# EAGLE design cj732 (EAGLE 7.7.0)
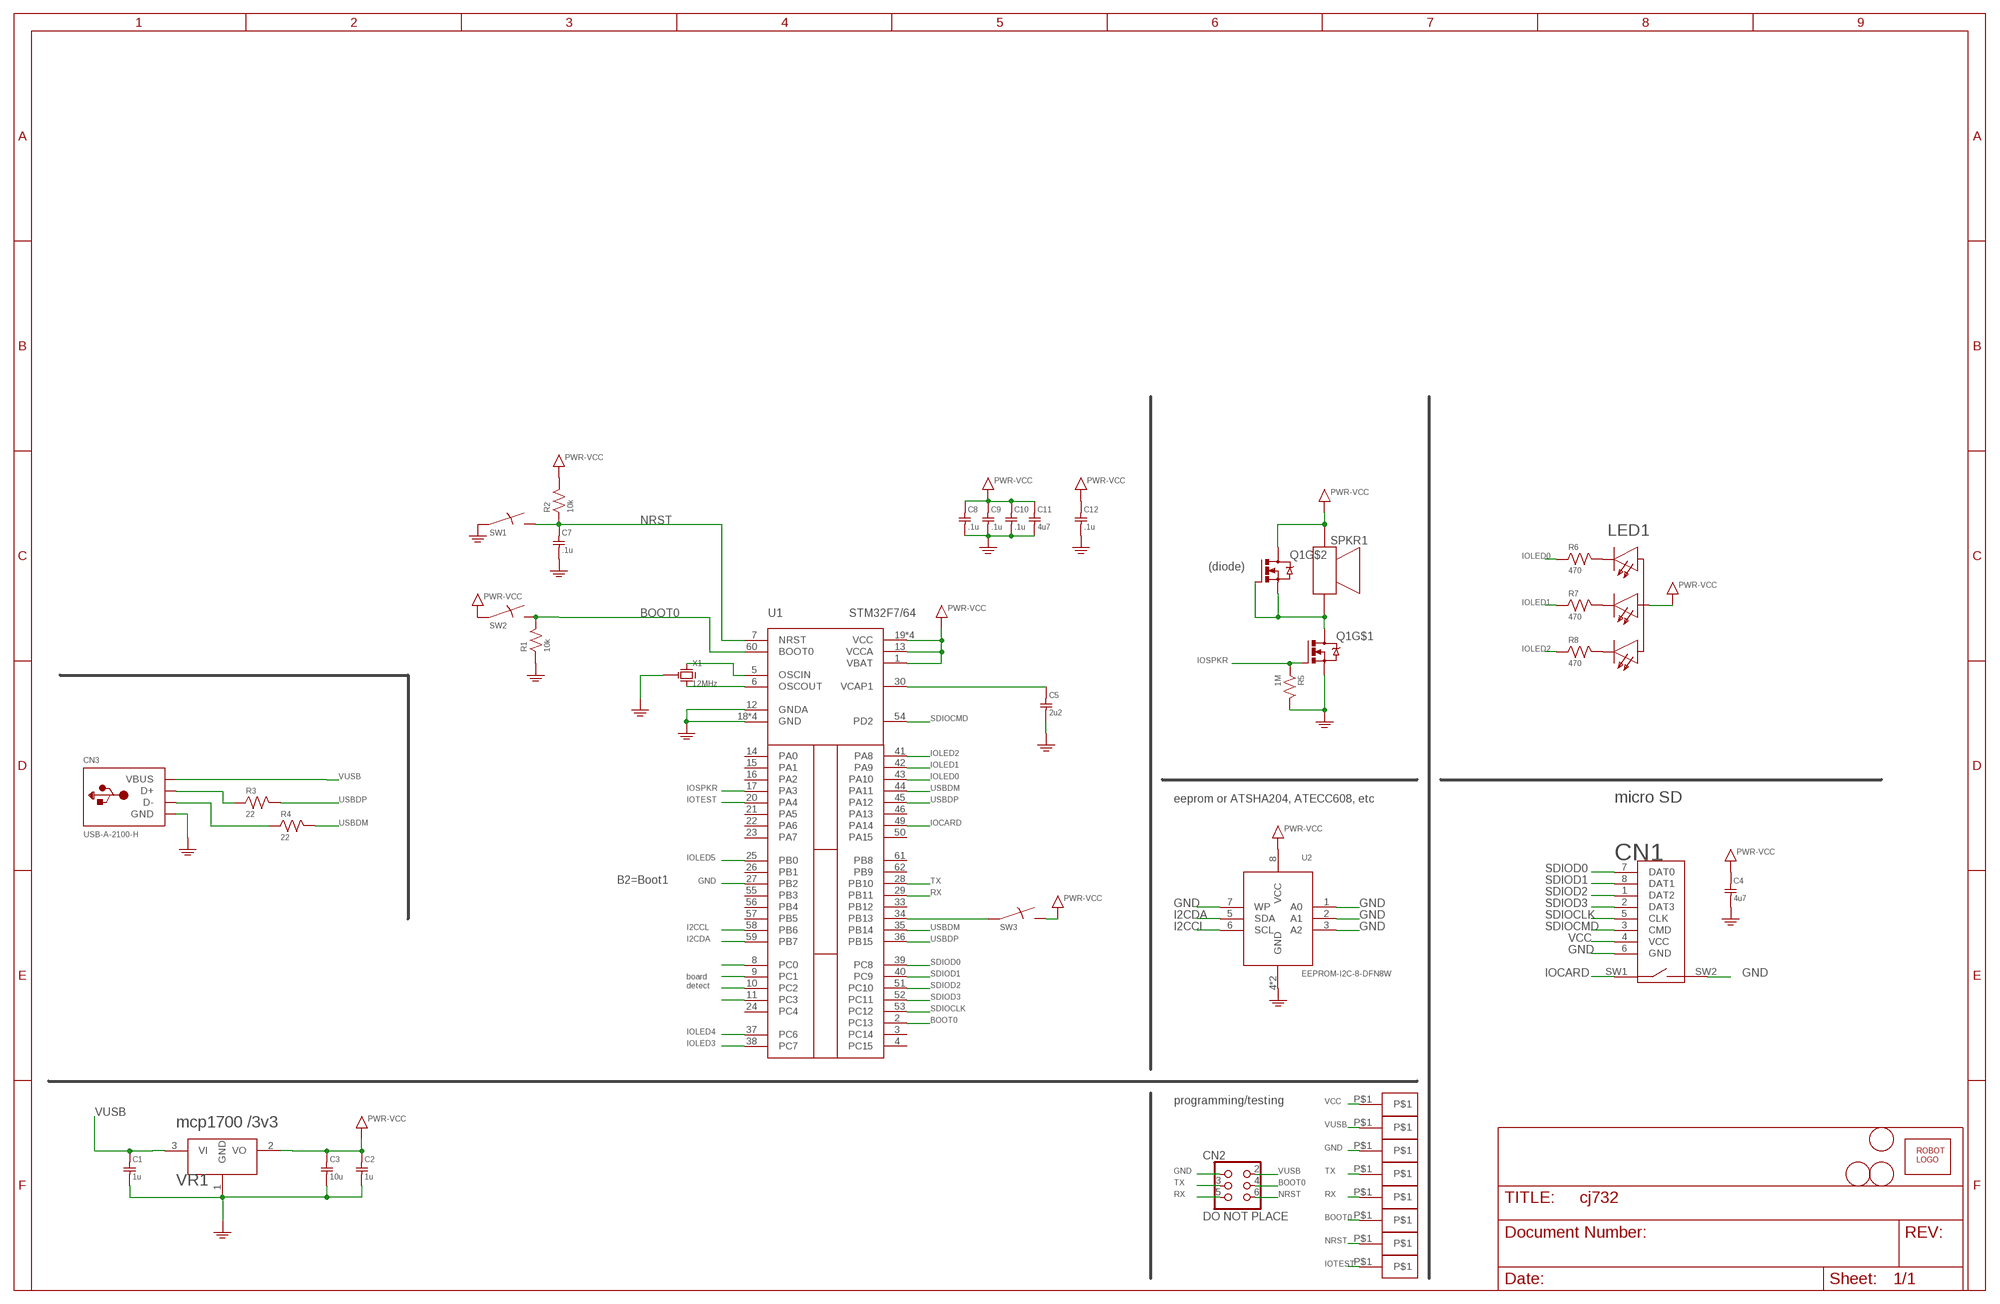
[diagram p0: schematic, sheet 1]

## Parts
C1  1u  C0603  [SMD0603]
C2  1u  C0603  [SMD0603]
C3  10u  C0603  [SMD0603]
C4  4u7  C0603  [SMD0603]
C5  2u2  C0603  [SMD0603]
C7  .1u  C0603  [SMD0603]
C8  .1u  C0603  [SMD0603]
C9  .1u  C0603  [SMD0603]
C10  .1u  C0603  [SMD0603]
C11  4u7  C0603  [SMD0603]
C12  .1u  C0603  [SMD0603]
CN1  MICROSDPLAIN  [MICROSD/MOLEX/FRONT/PLAIN]
CN2  DO NOT PLACE  HEADER-3X2-PTH1.27  [HEADER-3X2-PTH1.27]
CN3  USB-A-2100-H  [MOLEX_480372100-HOLE]
CN4  HEADER-1X1-SPOT  [SPOT]
CN5  HEADER-1X1-SPOT  [SPOT]
CN6  HEADER-1X1-SPOT  [SPOT]
CN7  HEADER-1X1-SPOT  [SPOT]
CN8  HEADER-1X1-SPOT  [SPOT]
CN9  HEADER-1X1-SPOT  [SPOT]
CN10  HEADER-1X1-SPOT  [SPOT]
CN11  HEADER-1X1-SPOT  [SPOT]
LED1  LED-RGB-CA-PLCC4  [PLCC4-3228]
Q1  MOSFET-2N  [SC-70-6]
R1  10k  R0603  [SMD0603]
R2  10k  R0603  [SMD0603]
R3  22  R0603  [SMD0603]
R4  22  R0603  [SMD0603]
R5  1M  R0603  [SMD0603]
R6  470  R0603  [SMD0603]
R7  470  R0603  [SMD0603]
R8  470  R0603  [SMD0603]
SPKR1  SPKR-PUI-0440  [PUI-0440]
SW1  SWITCH-PTS810  [PTS810]
SW2  SWITCH-PTS810  [PTS810]
SW3  SWITCH-PTS810  [PTS810]
U1  STM32F7/64  [TQFP64]
U2  EEPROM-I2C-8-DFN8W  [TDFN8EPW]
U$1  ROBOTMAN-LOGO  [ROBOTMAN-LOGO]
U$2  FIDUCIAL  [FIDUCIAL_1MM]
U$3  FIDUCIAL  [FIDUCIAL_1MM]
U$4  FIDUCIAL  [FIDUCIAL_1MM]
VR1  mcp1700 /3v3  REGULATOR-SOT23-3  [SOT-23-3@1]
X1  12MHz  RESONATORCTCE  [RESONATOR-CSTCE]

## Nets
BOOT0: CN2.4 CN8.P$1 R1.2 SW2.P$2 SW2.P$2B U1.2(PC13) U1.60(BOOT0)
GND: C1.2 C2.2 C3.2 C4.2 C5.2 C7.2 C8.2 C9.2 C10.2 C11.2 C12.2 CN1.6(GND) CN1.SW2 CN2.1 CN3.4(GND) CN3.P$1(GND) CN3.P$2(GND) CN5.P$1 Q1.1(S) R1.1 R5.2 SW1.P$1 SW1.P$1B U1.12(GNDA) U1.18(GND) U1.27(PB2) U1.31(GND) U1.47(GND) U1.63(GND) U2.1(A0) U2.2(A1) U2.3(A2) U2.4(GND) U2.7(WP) U2.PAD(GND) VR1.1(GND) X1.2(G) ; supply symbol labelled PWR-GND
I2CCL: U1.58(PB6) U2.6(SCL)
I2CDA: U1.59(PB7) U2.5(SDA)
IOCARD: CN1.SW1 U1.49(PA14)
IOLED0: R6.1 U1.43(PA10)
IOLED1: R7.1 U1.42(PA9)
IOLED2: R8.1 U1.41(PA8)
IOLED3: U1.38(PC7)
IOLED4: U1.37(PC6)
IOLED5: U1.25(PB0)
IOSPKR: Q1.2(G) R5.1 U1.17(PA3)
IOTEST: CN11.P$1 U1.20(PA4)
N$1: LED1.P$4(CB) R7.2
N$2: SW3.P$1 SW3.P$1B U1.34(PB13)
N$3: LED1.P$2(CR) R8.2
N$4: U1.8(PC0)
N$5: LED1.P$3(CG) R6.2
N$7: CN3.2(D-) R4.1
N$8: CN3.3(D+) R3.1
N$9: U1.9(PC1)
N$10: U1.10(PC2)
N$11: U1.11(PC3)
N$12: U1.5(OSCIN) X1.1(X1)
N$13: U1.6(OSCOUT) X1.3(X2)
N$14: Q1.4(S) Q1.5(G) Q1.6(D) SPKR1.P$2(P2)
N$18: C5.1 U1.30(VCAP1)
NRST: C7.1 CN2.6 CN9.P$1 R2.1 SW1.P$2 SW1.P$2B U1.7(NRST)
RX: CN2.5 CN7.P$1 U1.29(PB11)
SDIOCLK: CN1.5(CLK) U1.53(PC12)
SDIOCMD: CN1.3(CMD) U1.54(PD2)
SDIOD0: CN1.7(DAT0) U1.39(PC8)
SDIOD1: CN1.8(DAT1) U1.40(PC9)
SDIOD2: CN1.1(DAT2) U1.51(PC10)
SDIOD3: CN1.2(DAT3) U1.52(PC11)
TX: CN2.3 CN6.P$1 U1.28(PB10)
USBDM: R4.2 U1.35(PB14) U1.44(PA11)
USBDP: R3.2 U1.36(PB15) U1.45(PA12)
VCC: C2.1 C3.1 C4.1 C8.1 C9.1 C10.1 C11.1 C12.1 CN1.4(VCC) CN10.P$1 LED1.P$1(A) Q1.3(D) R2.2 SPKR1.P$1(P1) SW2.P$1 SW2.P$1B SW3.P$2 SW3.P$2B U1.1(VBAT) U1.13(VCCA) U1.19(VCC) U1.32(VCC) U1.48(VCC) U1.64(VCC) U2.8(VCC) VR1.2(VO) ; supply symbol labelled PWR-VCC
VUSB: C1.1 CN2.2 CN3.1(VBUS) CN4.P$1 VR1.3(VI)
Unconnected: U1.3(PC14) U1.4(PC15) U1.14(PA0) U1.15(PA1) U1.16(PA2) U1.21(PA5) U1.22(PA6) U1.23(PA7) U1.24(PC4) U1.26(PB1) U1.33(PB12) U1.46(PA13) U1.50(PA15) U1.55(PB3) U1.56(PB4) U1.57(PB5) U1.61(PB8) U1.62(PB9)

## Notes on the sheet
- (diode)
- eeprom or ATSHA204, ATECC608, etc | micro SD
- B2=Boot1
- board
  detect
- programming/testing

## Library data of the parts
C1-C5 C7-C12 = jaw:C
CN1 = jaw:MICROSD
CN2 = jaw-conn:HEADER-3X2
CN3 = jaw-conn:USB-A: USB type A 'plug' Used for things that can directly connect to a USB port, say USB key
CN4-CN11 = jaw-conn:HEADER-1X1
LED1 = jaw:LED-RGB-CA
Q1 = jaw:MOSFET-2N
R1-R8 = jaw:R
SPKR1 = jaw:SPKR
SW1-SW3 = jaw:SWITCH
U1 = jaw-ic:STM32F7/64
U2 = jaw:EEPROM-I2C-8
U$1 = jaw:ROBOTMAN-LOGO
U$2-U$4 = adafruit:FIDUCIAL: For use by pick and place machines to calibrate the vision/machine, 1mm By microbuilder.eu
VR1 = jaw:REGULATOR
X1 = jaw:RESONATOR

## Board
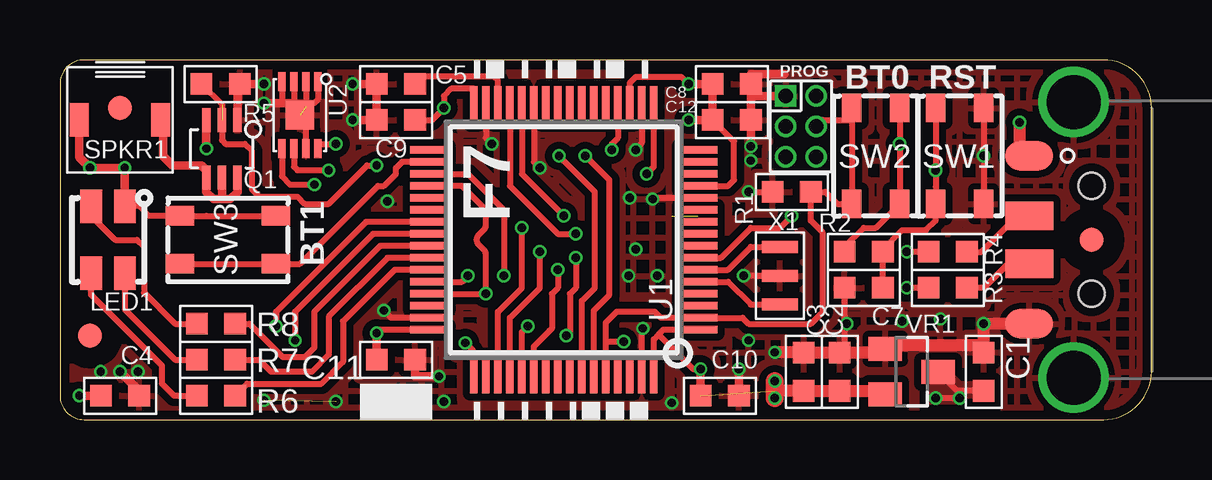
[diagram p1: board, top side]
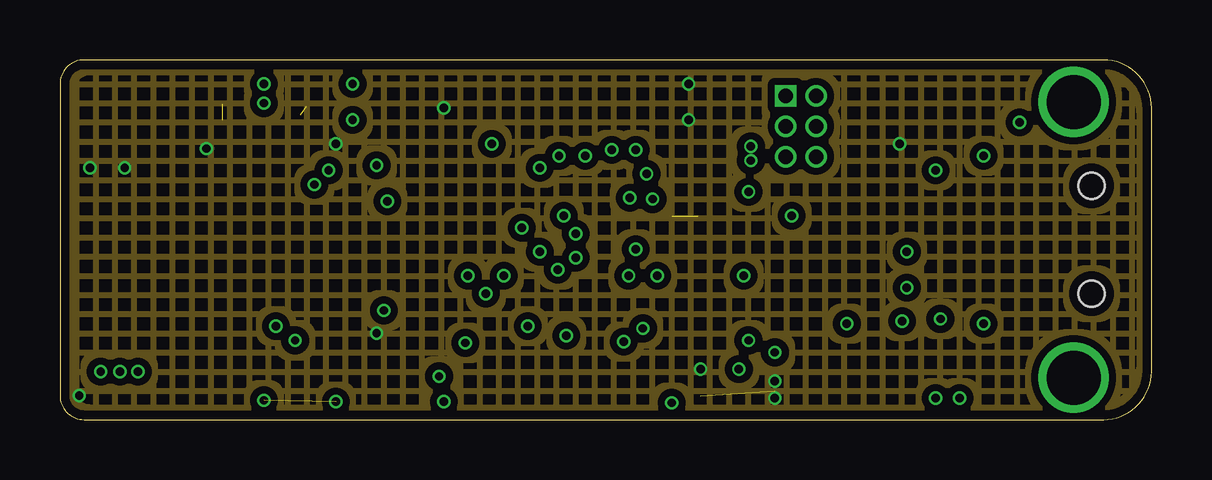
[diagram p2: board, inner layer Route2]
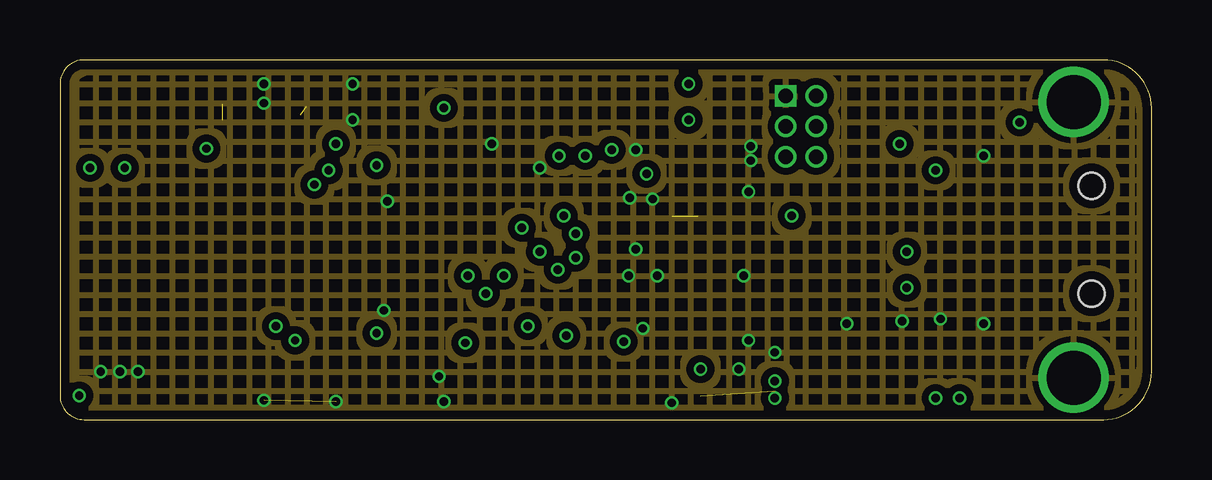
[diagram p3: board, inner layer Route15]
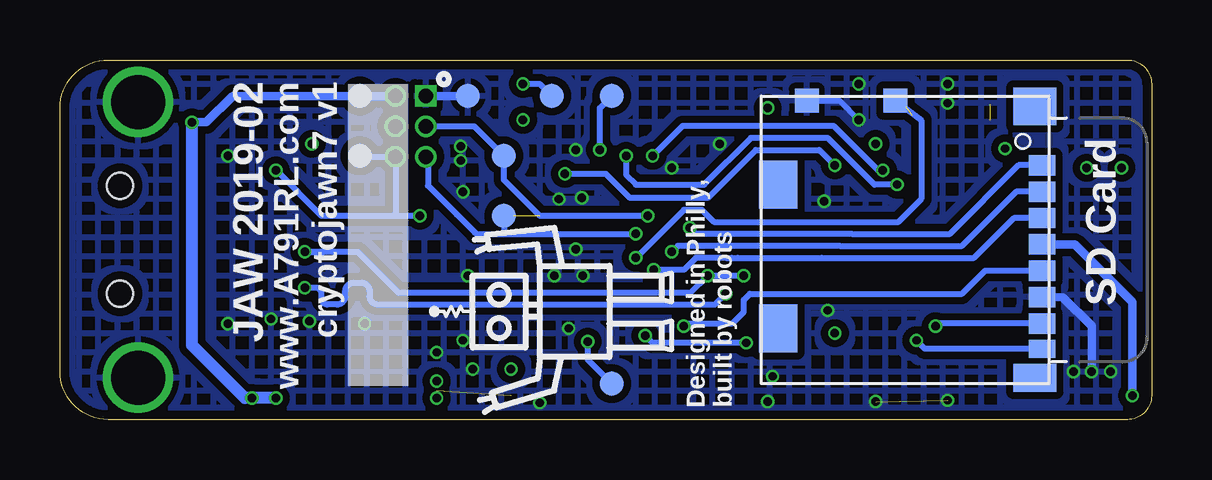
[diagram p4: board, bottom side, seen from below]

Size 45.5 x 15 mm. Coordinates in mm from the lower left corner, seen from the top.
Outline: 45.5,2 45.5,13 arc90 43.5,15 1,15 arc90 0,14 0,1 arc90 1,0 43.5,0 arc90 45.5,2
Copper layers (1*2*15*16): Top 0.035559375mm / dielectric 0.17018125mm / Route2 0.01778125mm / dielectric 47mil / Route15 0.01778125mm / dielectric 0.17018125mm / Bottom 0.035559375mm
Design rules "OSHPark-4layer *": minimum track width 5mil, minimum drill 10mil, track to track 7mil, track to pad 7mil, pad to pad 7mil, via to via 7mil, smd to smd 5mil, copper to edge 15mil, drill to drill 6mil, minimum pad ring 4mil, minimum via ring 4mil, stop-mask expansion 4mil, vias tented up to drill 0.5mm, thermal gap 10mil

### Footprints (pad centres in the part's own frame; a part is rotated, then mirrored left to right if it is on the bottom)
SMD0603 = smd 0.9 x 0.9: 1 -0.8,0; 2 0.8,0
MICROSD/MOLEX/FRONT/PLAIN = smd 0.85 x 1.1: 1 3.105,-4.43; 2 2.005,-4.43; 3 0.905,-4.43; 4 -0.195,-4.43; 5 -1.295,-4.43; 6 -2.395,-4.43; 7 -3.495,-4.43 | smd 0.75 x 1.1: 8 -4.545,-4.43 | smd 1.17 x 1.8: P$1 -5.755,-4.13 | smd 1.55 x 1.8: P$2 5.565,-4.13 | smd 2 x 1.6: P$3 -3.7,6.57; P$4 2.3,6.57 | smd 1 x 1: SW1 5.8,1.67; SW2 5.8,5.37
HEADER-3X2-PTH1.27 = drill 0.6 pad 0.9 square: 1 0,0 | drill 0.6 pad 0.9: 2 0,1.27; 3 1.27,0; 4 1.27,1.27; 5 2.54,0; 6 2.54,1.27
MOLEX_480372100-HOLE = smd 1.2 x 2: 1 -3.5,-9.6; 2 -1,-9.6; 3 1,-9.6; 4 3.5,-9.6 | drill 2.25 pad 2.75: P$1 -5.75,-7.75; P$2 5.75,-7.75 | hole 1.1: -2.25,-7; 2.25,-7
SPOT = smd 1 x 1: P$1 0,0
PLCC4-3228 = smd 1.4 x 0.9: P$1 -1.4,0.7; P$2 -1.4,-0.7; P$3 1.4,-0.7; P$4 1.4,0.7
SC-70-6 = smd 1 x 0.35: 1 -1.2,0.65; 2 -1.2,0; 3 -1.2,-0.65; 4 1.2,-0.65; 5 1.2,0; 6 1.2,0.65
PUI-0440 = smd 0.8 x 1.4: P$1 -1.7,0; P$2 1.7,0
PTS810 = smd 0.8 x 1.2: P$1 -1,-2; P$1B -1,2; P$2 1,-2; P$2B 1,2
TQFP64 = smd 1.6 x 0.3: 1 -5.6,3.75; 2 -5.6,3.25; 3 -5.6,2.75; 4 -5.6,2.25; 5 -5.6,1.75; 6 -5.6,1.25; 7 -5.6,0.75; 8 -5.6,0.25; 9 -5.6,-0.25; 10 -5.6,-0.75; 11 -5.6,-1.25; 12 -5.6,-1.75; 13 -5.6,-2.25; 14 -5.6,-2.75; 15 -5.6,-3.25; 16 -5.6,-3.75; 33 5.6,-3.75; 34 5.6,-3.25; 35 5.6,-2.75; 36 5.6,-2.25; 37 5.6,-1.75; 38 5.6,-1.25; 39 5.6,-0.75; 40 5.6,-0.25; 41 5.6,0.25; 42 5.6,0.75; 43 5.6,1.25; 44 5.6,1.75; 45 5.6,2.25; 46 5.6,2.75; 47 5.6,3.25; 48 5.6,3.75 | smd 0.3 x 1.6: 17 -3.75,-5.6; 18 -3.25,-5.6; 19 -2.75,-5.6; 20 -2.25,-5.6; 21 -1.75,-5.6; 22 -1.25,-5.6; 23 -0.75,-5.6; 24 -0.25,-5.6; 25 0.25,-5.6; 26 0.75,-5.6; 27 1.25,-5.6; 28 1.75,-5.6; 29 2.25,-5.6; 30 2.75,-5.6; 31 3.25,-5.6; 32 3.75,-5.6; 49 3.75,5.6; 50 3.25,5.6; 51 2.75,5.6; 52 2.25,5.6; 53 1.75,5.6; 54 1.25,5.6; 55 0.75,5.6; 56 0.25,5.6; 57 -0.25,5.6; 58 -0.75,5.6; 59 -1.25,5.6; 60 -1.75,5.6; 61 -2.25,5.6; 62 -2.75,5.6; 63 -3.25,5.6; 64 -3.75,5.6
TDFN8EPW = smd 0.8 x 0.3: 1 -1.4,0.75; 2 -1.4,0.25; 3 -1.4,-0.25; 4 -1.4,-0.75; 5 1.4,-0.75; 6 1.4,-0.25; 7 1.4,0.25; 8 1.4,0.75 | smd 1.2 x 1.2: PAD 0,0
FIDUCIAL_1MM = smd 1 x 1: 1 0,0
SOT-23-3@1 = smd 1 x 1.4: 1 -0.95,-1.1; 2 0.95,-1.1; 3 0,1.1
RESONATOR-CSTCE = smd 0.5 x 1.5: 1 -1.2,0; 2 0,0; 3 1.2,0

### Placement (x,y rotation side)
C1  38.5,2 90 top
C2  32.5,2 90 top
C3  31,2 90 top
C4  2.5,1 0 top
C5  14,14 180 top
C7  33.5,5.5 180 top
C8  28,14 0 top
C9  14,12.5 180 top
C10  27.5,1 0 top
C11  14,2.5 0 top
C12  28,12.5 0 top
CN1  9,7.5 90 bottom
CN2  30.25,13.5 270 top
CN3  50,7.5 270 top
CN4  33,13.5 0 bottom
CN5  28.5,13.5 0 bottom
CN6  27,11 0 bottom
CN7  27,8.5 0 bottom
CN8  22.5,1.5 0 bottom
CN9  33,11 0 bottom
CN10  25,13.5 0 bottom
CN11  22.5,13.5 0 bottom
LED1  2,7.5 270 top
Q1  6.75,11.3 270 top
R1  30.5,9.5 0 top
R2  33.5,7 180 top
R3  37,5.5 180 top
R4  37,7 180 top
R5  6.7,14 0 top
R6  6.5,1 180 top
R7  6.5,2.5 180 top
R8  6.5,4 180 top
SPKR1  2.5,12.5 0 top
SW1  37.5,11 180 top
SW2  34,11 180 top
SW3  7,7.5 90 top
U1  21,7.5 180 top
U2  10,12.7 270 top
U$1  24.3,4.51 90 bottom
U$2  2.5,13 0 top
U$3  43,7.5 0 top
U$4  1.25,3.5 0 top
VR1  35.5,2 270 top
X1  30,6 90 top

### Tracks (layer width: path | path; a pad name or v marks a point on that pad's centre or on a via)
BOOT0  (via drill 0.35)
  Top 0.25: U1.60 22.75,3.25 | 22.75,3.25 22.75,4.05 23.2,4.5 24.8,4.5 25.05,4.25 U1.2 28.45,4.25 28.7,4 31.3,4 31.8,4.5 31.8,7.8 31.3,8.3 R1.2 31.9,9.5 32.4,9 SW2.P$2B 33,12.5 | SW2.P$2 33,12.5 | CN2.4 31.79,12.5 33,12.5 | v23.5,3.25 22.75,3.25
  Bottom 0.25: CN8.P$1 23.5,2.5 v23.5,3.25
GND  (via drill 0.35)  (2 unrouted)
  Top 0.25: SW1.P$1 v38.5,11 SW1.P$1B | C7.2 32.7,3 C2.2 | X1.2 v28.5,6 | 14.8,2.4 C11.2 | U1.63 24.25,3.75 v24.3,3.8 | U1.27 19.75,10.75 v20,10.5 | U1.18 24.25,11.55 v24,11.25 | U1.12 24.75,9.25 v24.7,9.2 | U2.1 10.75,13.35 10.6,13.2 | 10.6,13.2 10.3,13.2 | 10.3,13.2 10.25,13.2 | 10.25,13.2 9.7,13.2 9.75,13.05 U2.3 | U2.2 10.25,13.2 | 10.25,13.2 10.25,13.05 10.3,13.2 | 9.2,13.2 9.25,13.25 U2.4 9.25,13.8 | U2.7 10.25,13.2 | 10.25,13.2 10.6,13.2 | v28.7,9.5 R1.1 | U1.47 13.8,4.25 v13.5,4.55 | U1.31 17.75,11.75 v18,11.5
  Top 0.35: 14.8,2.4 14.8,1.8 v15.8,1.8 | v12.2,14 C5.2 C9.2 v12.2,12.5 | C10.2 v28.3,2.1 | 28.8,13.9 C12.2 v28.8,11.4 | 28.8,13.9 C8.2 28.8,14.4 30.2,14.4 | 9.7,13.2 9.2,13.2 v8.5,13.2 | C4.2 3.3,1.2 v2.5,2 | R5.2 v8.5,14 | 7.4,13.9 R5.2 | Q1.1 7.4,13.9 | 7.4,13.9 R5.2 | 28.8,13.9 28.8,13.5 30.2,13.5
  Top 0.5: VR1.1 34.25,2.8 C2.2 C3.2 v29.8,2.8 | CN3.4 v38.5,4 38.5,3.5 C1.2 38.5,3.1 34.5,3.1
  Bottom 0.25: CN1.SW2 13,13.3 v12.2,12.5
  Bottom 0.35: CN1.6 3.7,5.1 2.5,3.9 2.5,2.6 v2.5,2 | CN5.P$1 CN2.1
  other vias: 28.8,10.8 8.5,0.8 36.7,4.2 28.7,3.3 11.5,0.75 23.75,9.25 24.9,6 23.7,6 25.5,0.7 35.1,4.1 24,7.1 3.25,2 1.7,2 13.65,9.1 32.8,4 16,0.75
  pour Route15 (isolate 0.3, hatched): -0.2,15 45.7,15 45.7,0 -0.2,0
  pour Bottom (isolate 0.3, hatched): -0.2,15 45.7,15 45.7,0 -0.2,0
  pour Top (isolate 0.3, rank 5, hatched): -0.2,15 45.7,15 45.7,0 -0.2,0
I2CCL  (via drill 0.35)
  Top 0.25: U2.6 9.75,10.55 9.9,10.4 v11.2,10.4 | U1.58 21.75,4.95 22.3,5.5 22.3,9.5 v20.8,11
  Bottom 0.25: v20.8,11 19.55,12.25 13.25,12.25 11.4,10.4 v11.2,10.4
I2CDA  (via drill 0.35)
  Top 0.25: U1.59 22.25,4.55 22.9,5.2 22.9,10 v21.9,11 | U2.5 9.25,10.15 9.6,9.8 v10.6,9.8
  Bottom 0.25: v21.9,11 21.9,10.2 21.5,9.8 18.65,9.8 16.7,11.75 13.5,11.75 11.55,9.8 v10.6,9.8
IOCARD  (via drill 0.35)
  Top 0.25: U1.49 17.25,2.75 17.2,2.9 v16.9,3.2 | v21.5,6.75 21.5,5.5 21.25,5.25 21.25,3.65 v21.1,3.5
  Bottom 0.25: CN1.SW1 9.6,12.48 9.6,9.2 10.55,8.25 18.25,8.25 18.75,8.75 19.5,8.75 v21.5,6.75 | v16.9,3.2 20.8,3.2 v21.1,3.5
IOLED0
  Top 0.25: U1.43 13.95,6.25 11.8,4.1 11.8,2.4 10.9,1.5 7.8,1.5 R6.1
IOLED1
  Top 0.25: U1.42 13.65,6.75 11.2,4.3 11.2,2.7 10.5,2 8.8,2 8.3,2.5 R7.1
IOLED2
  Top 0.25: U1.41 13.35,7.25 10.6,4.5 10.6,3 10.2,2.6 9.3,2.6 7.9,4 R8.1
IOSPKR  (via drill 0.35)  (1 unrouted)
  Top 0.25: v13.2,10.6 12.8,10.6 11.2,9 10.2,9 9.9,9.3 8.3,9.3 8,9.6 8,11.2 7.7,11.5 6.9,11.5 6.75,11.65 6.75,13.15 R5.1 | v24.45,10.25 24.75,10.55 U1.17
  Bottom 0.25: v24.45,10.25 22.75,10.25 21.75,9.25 21.65,9.25 18.5,9.25 16.5,11.25 13.85,11.25 v13.2,10.6
IOTEST  (via drill 0.35)
  Top 0.25: U1.20 23.25,11.75 23,11.5 v23,11.25
  Bottom 0.25: v23,11.25 23,13 CN11.P$1
N$1
  Top 0.25: LED1.P$4 2.7,4.6 4.8,2.5 R7.2
N$2
  Top 0.25: U1.34 14.25,10.75 14,10.5 14,10.25 13.5,9.75 13.25,9.75 10,6.5 SW3.P$1 SW3.P$1B
N$3
  Top 0.25: LED1.P$2 1.3,8.5 2.3,7.5 3.2,7.5 3.5,7.2 3.5,5.3 4.8,4 R8.2
N$5
  Top 0.25: R6.2 4.9,1 4.75,1 4.25,1.5 4.25,2.25 2,4.5 1.3,5.2 LED1.P$3
N$6
  cutout Top: 9,14.5 11,14.5 11,13.5 9,13.5
N$7
  Top 0.25: R4.1 38,7 38.4,7 39.9,8.5 CN3.2
N$8
  Top 0.25: R3.1 38.5,5.5 39.5,6.5 CN3.3
N$12
  Top 0.25: U1.5 27.85,5.75 28.8,4.8 X1.1
N$13
  Top 0.25: U1.6 27.85,6.25 28.8,7.2 X1.3
N$14
  Top 0.35: 4.35,12.35 4.3,12.4 | 4.3,12.4 SPKR1.P$2 | 4.2,13 SPKR1.P$2 | Q1.6 7.4,9.5 7.1,9.2 6.7,9.2 | 4.3,12.4 4.3,11 4.7,10.6 5.9,10.6 6.1,10.4 Q1.4 6.1,9.5 6.4,9.2 6.7,9.2 | 4.3,12.4 SPKR1.P$2 | Q1.5 6.75,9.25 6.7,9.2
N$18
  Top 0.25: U1.30 18.25,14.15 18.1,14.3 15.1,14.3 C5.1
NRST  (via drill 0.35)
  Top 0.25: SW1.P$2 v36.5,10.4 | v36.5,10.4 36.5,9.7 | 36.5,9.7 SW1.P$2B 36.5,8.3 36.1,7.9 35.1,7.9 34.3,7.1 R2.1 C7.1 | U1.7 27.55,6.75 28.8,8 30,8 v30.5,8.5 | v36.5,10.4 36.5,9.7
  Bottom 0.25: v30.5,8.5 31.6,8.5 | 31.6,8.5 32.4,8.5 34.6,8.5 v36.5,10.4 | 31.6,8.5 31.52,8.58 CN2.6 32.96,10.96 CN9.P$1
RX  (via drill 0.35)
  Top 0.25: U1.29 18.75,9.75 20.75,7.75 v21.5,7.75
  Bottom 0.25: CN2.5 30.16,10.82 30.16,9.76 28.95,8.55 28.2,7.8 28.15,7.75 27,7.75 | 27,7.75 v21.5,7.75 | CN7.P$1 27,7.75
SDIOCLK  (via drill 0.35)
  Top 0.25: U1.53 19.25,3.65 v19.5,3.9
  Bottom 0.25: v19.5,3.9 19.35,4 17.5,4 17,4.5 17,4.9 17,5 16.75,5.25 7.9,5.25 6.95,6.2 CN1.5
SDIOCMD  (via drill 0.35)
  Top 0.25: U1.54 19.75,3.05 20.4,3.7 20.5,3.8 20.5,5.25 20.75,5.5 v20.75,6.25
  Bottom 0.25: v20.75,6.25 20.5,6.25 19.5,6.25 19,6.75 17.75,6.75 17.5,6.75 17.25,6.75 13.75,6.75 7.4,6.75 5.75,8.41 CN1.3
SDIOD0  (via drill 0.35)
  Top 0.25: U1.39 12.75,8.25 9,4.5 v9,3.9
  Bottom 0.25: CN1.7 8.86,4.01 v9,3.9
SDIOD1  (via drill 0.35)
  Top 0.25: U1.40 13.05,7.75 9.8,4.5 v9.8,3.3
  Bottom 0.25: CN1.8 9.45,2.96 v9.8,3.3
SDIOD2  (via drill 0.35)
  Top 0.25: U1.51 18.25,4.45 18.25,4.5 19.25,5.5 19.25,6.25 19.25,6.75 v19.25,8
  Bottom 0.25: CN1.1 5.55,10.61 8.4,7.75 12.5,7.75 19,7.75 v19.25,8
SDIOD3  (via drill 0.35)
  Top 0.25: U1.52 18.75,4.15 18.75,4.25 20,5.5 v20,7
  Bottom 0.25: CN1.2 5.64,9.5 7.9,7.25 13,7.25 17,7.25 19.75,7.25 v20,7
TX  (via drill 0.35)  (1 unrouted)
  Top 0.25: U1.28 19.25,10.25 v21,8.5
  Bottom 0.25: v21,8.5 22,8.5 22.5,8.5 23.75,8.5 24.25,8.5 25.5,8.5 27,10 CN6.P$1 28.23,12.23 28.43,12.23 CN2.3 | 26.8,8.5 26.6,8.5
USBDM  (via drill 0.35)
  Top 0.25: R4.2 v35.3,7 | U1.35 17,10.25 18.5,8.75 v18.5,6 | U1.44 16.75,5.75 v17,6
  Bottom 0.25: 34.5,7 v35.3,7 33.1,7 31.4,5.3 19.2,5.3 v18.5,6 v17,6
USBDP  (via drill 0.35)
  Top 0.25: R3.2 v35.3,5.5 | U1.45 v17.75,5.25 17.75,6.9 arc45 17.68,7.07 17.46,7.29 arc-90 17.46,7.71 17.68,7.93 arc45 17.75,8.1 17.75,8.75 16.75,9.75 U1.36
  Bottom 0.25: v17.75,5.25 18.2,4.8 32.25,4.8 arc90 32.6,5.15 32.6,5.36 arc-90 32.94,5.71 33.26,5.71 arc-90 33.61,5.36 33.61,5.15 arc90 33.95,4.8 34.35,4.8 arc90 34.6,5.05 34.6,5.25 arc-90 34.85,5.5 v35.3,5.5
VCC  (via drill 0.35)  (1 unrouted)
  Top 0.25: SW2.P$1 v35,11.5 SW2.P$1B 34,8 33.5,8 32.7,7.2 R2.2 | U1.32 17.25,13.8 16.3,13.8 16,13.5 v16,13 15.5,12.5 C9.1 | U1.48 13.65,3.75 13.35,3.75 v13.2,3.6 | U1.64 24.75,3.35 24.95,3.55 | 24.95,3.55 25.1,3.7 25.15,3.75 U1.1 | v26.7,2.1 26.4,2.1 24.95,3.55 | U1.13 27.85,9.75 28.1,10 28.1,11.6 C12.1 | U1.19 23.75,14.05 24,14.3 25.9,14.3 v26.2,14 | U2.8 10.75,11.55 10.8,11.5 v11.5,11.5 | SW3.P$2 8.9,8.5 6.1,8.5 4.9,8.5 SW3.P$2B 3.7,8.5 3.3,8.9 LED1.P$1
  Top 0.35: C11.1 13.2,3.3 v13.2,3.6 | C10.1 v26.7,2.1 | v26.2,14 C8.1 C12.1 v26.2,12.5 | v0.8,1 C4.1 | Q1.3 v6.1,11.3 | LED1.P$1 v2.7,10.5 v1.25,10.5 0.8,10.95 SPKR1.P$1
  Top 0.5: VR1.2 34.25,1.2 C2.1 C3.1 29.8,1.2 v29.8,0.9
  Top 0.75: v29.8,0.9 v29.8,1.6
  Bottom 0.25: CN10.P$1 25.5,14 v26.2,14
  Bottom 0.35: CN1.4 3.2,7.3 0.8,4.9 0.8,3.8 v0.8,1
  pour Route2 (isolate 0.3, hatched): -0.2,15 45.7,15 45.7,0 -0.2,0
VUSB  (via drill 0.35)
  Top 0.25: C1.1 37.5,1.2 | 37.5,1.2 37.4,1.2 VR1.3 | v37.5,0.9 37.5,1 | 37.5,1 37.5,1.2 | v36.5,0.9 37.4,0.9 37.5,1
  Top 0.5: CN3.1 40,11 v40,12.4
  Bottom 0.35: CN2.2 32.5,13.5 | 32.5,13.5 CN4.P$1 | CN4.P$1 38.3,13.5 39.4,12.4 v40,12.4 | CN4.P$1 32.5,13.5
  Bottom 0.5: v40,12.4 40,9.2 40,3.1 37.8,0.9 v37.5,0.9 v36.5,0.9
  pour Top (isolate 0.3, no thermals): 38.25,1 37.75,1 37.5,0.75 36.25,0.75 36.25,2 37,2 37.5,1.5 38.25,1.5

### Text on the board
tPlace: PROG | BT0 | RST | F7 | BT1
bPlace: cryptojawn7 v1 | www.A791RL.com | JAW 2019-02 | SD Card | Designed in Philly, / built by robots